# Altium schematic sheet DASH_CAN.SchDoc
size A
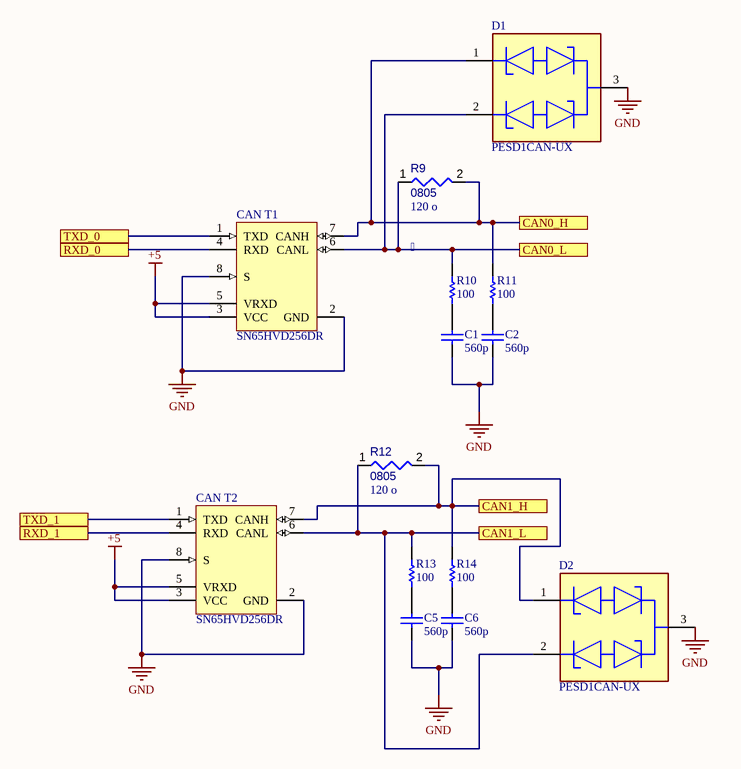
[diagram p0: DASH_CAN.SchDoc]

## Parts
C1  560p  [CAPC1608X87X35NL15T15]
C2  560p  [CAPC1608X87X35NL15T15]
C5  560p  [CAPC1608X87X35NL15T15]
C6  560p  [CAPC1608X87X35NL15T15]
CAN_T1  SN65HVD256DR  [D0008A_L]
CAN_T2  SN65HVD256DR  [D0008A_L]
D1  PESD1CAN-UX  [FP-SOT323-MFG]
D2  PESD1CAN-UX  [FP-SOT323-MFG]
R9  0805  value 120 o  Max Operating Temperature:   [RESC0805(2012)_L]
R10  100  [RESC1608X55X25ML10T15]
R11  100  [RESC1608X55X25ML10T15]
R12  0805  value 120 o  [RESC0805(2012)_L]
R13  100  [RESC1608X55X25ML10T15]
R14  100  [RESC1608X55X25ML10T15]

## Ports
CAN0_H, CAN0_L, CAN1_H, CAN1_L, RXD_0, RXD_1, TXD_0, TXD_1

## Nets
+5: CAN_T1.3(VCC) CAN_T1.5(VRXD) CAN_T2.3(VCC) CAN_T2.5(VRXD)
GND: C1.1 C2.1 C5.1 C6.1 CAN_T1.2(GND) CAN_T1.8(S) CAN_T2.2(GND) CAN_T2.8(S) D1.3(common_cathode) D2.3(common_cathode)
CAN0_H: CAN_T1.7(CANH) D1.1(cathode_1) R9.2 R11.2 ; port CAN0_H
CAN0_L: CAN_T1.6(CANL) D1.2(cathode_2) R9.1 R10.2 ; port CAN0_L
CAN1_H: CAN_T2.7(CANH) D2.1(cathode_1) R12.2 R14.2 ; port CAN1_H
CAN1_L: CAN_T2.6(CANL) D2.2(cathode_2) R12.1 R13.2 ; port CAN1_L
RXD_0: CAN_T1.4(RXD) ; port RXD_0
RXD_1: CAN_T2.4(RXD) ; port RXD_1
TXD_0: CAN_T1.1(TXD) ; port TXD_0
TXD_1: CAN_T2.1(TXD) ; port TXD_1
NetC1_2: C1.2 R10.1
NetC2_2: C2.2 R11.1
NetC5_2: C5.2 R13.1
NetC6_2: C6.2 R14.1

## Library data of the parts
C1 C2 C5 C6 = CMP-2006-03887-1: .1 uf; Part Number: C0603C104J3RAC7867; Manufacturer: Kemet
CAN_T1 CAN_T2 = CMP-0315-00070-2: CAN Transceiver with Fast Loop Times for Highly Loaded Networks, 85 mA, 5 V, -40 to 125 degC, 8-pin SOIC (D), Green (RoHS & no Sb/Br); Manufacturer: Texas Instruments; ICC(Max)(mA): 85; Supply Voltage(s)(V): 5; Drivers Per Package: 1; Rating: Catalog; Bus Fault Voltage(V): -27 to 40; Features: Short prop delay, Fast loop times, RXD supply input; PackageReference: D0008A; ComponentLink1Description: Datasheet; Code_JEDEC: MS-012AA; PackageDescription: 8-Pin Plastic Small Outline Integrated Circuit, 4.9 x 3.9 mm, Pitch 1.27 mm Pitch; PackageVersion: revM, Jun-2011; PartNumber: SN65HVD256DR; Isolated: No; Eco-Plan: Green (RoHS & no Sb/Br); ComponentLink1URL: http://www.ti.com/general/docs/lit/getliterature.tsp?genericPartNumber=SN65HVD256&fileType=pdf; Footprint: TJA1051T/3; Mounting Technology: Surface Mount; Receivers Per Package: 1; SubFamily: CAN; DatasheetVersion: SLLSEA2
D1 D2 = CMP-14436-000006-1: TVS DIODE 24V 50V SC70-3
R9 R12 = CMP-009-000170-1: Chip Resistor, 4,7 Ohms, +/-5 %, 125 mW, -55 to 155 degC, 0805; Available Preview Images: 2D; Design Item ID: CMP-009-00174-2; Source: Integrated_Library - 12.03.21 - 15.39.SchLib
R10 R11 R13 R14 = CMP-009-000010-1: Chip Resistor, 0 Ohm, 0.1 W, -55 to 155 degC, 0603 (1608 Metric); Source: Integrated_Library - 12.03.21 - 15.39.SchLib; Design Item ID: CMP-009-00006-4